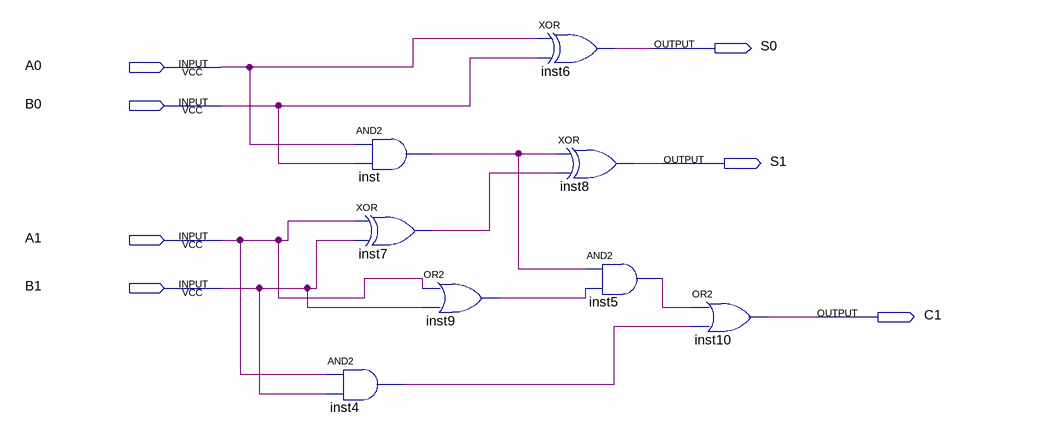
[diagram p0: schematic sheet]
// Quartus schematic lab2.bdf as structural Verilog: 8 symbols, 7 pins
module lab2 (
  input  A0,
  input  B0,
  input  A1,
  input  B1,
  output S0,
  output S1,
  output C1
);

  wire inst4_out, inst5_out, inst7_out, inst9_out, inst_out;

  and inst (inst_out, A0, B0);
  xor inst7 (inst7_out, A1, B1);
  and inst4 (inst4_out, A1, B1);
  or inst9 (inst9_out, A1, B1);
  xor inst6 (S0, A0, B0);
  xor inst8 (S1, inst_out, inst7_out);
  and inst5 (inst5_out, inst_out, inst9_out);
  or inst10 (C1, inst5_out, inst4_out);
endmodule
